# Altium schematic sheet MiniProject Schematic 2025.SchDoc: Mimi Project Circuit Schematic EC463
size A
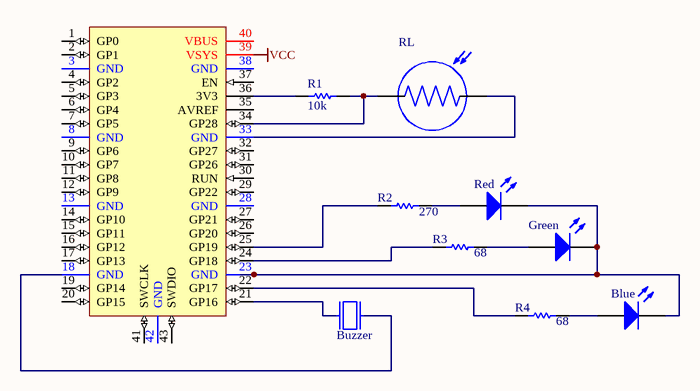
[diagram p0: MiniProject Schematic 2025.SchDoc]

## Parts
?  (no value)  [RPI-PICO-MOD]
Blue  Light-Emitting Diode  (value not drawn)
Green  Light-Emitting Diode  (value not drawn)
R1  value 10k  (hidden comment: Resistor)
R2  value 270  (hidden comment: Resistor)
R3  value 68  (hidden comment: Resistor)
R4  value 68  (hidden comment: Resistor)
Red  Light-Emitting Diode  (value not drawn)
RL  (no value)  [XDCR_PDV-P8003]

## Nets
VCC: ?.39(VSYS)
Net?_22: ?.22(GP17) R4.1
Net?_23: ?.23(GND) Blue.2(K) Green.2(K) Red.2(K)
Net?_24: ?.24(GP18) R3.1
Net?_25: ?.25(GP19) R2.1
Net?_33: ?.33(GND) RL.2
Net?_34: ?.34(GP28) R1.2 RL.1
Net?_36: ?.36(3V3) R1.1
NetBlue_1: Blue.1(A) R4.2
NetGreen_1: Green.1(A) R3.2
NetR2_2: R2.2 Red.1(A)

Not connected (* = marked no-connect by the designer): ? 1(GP0) 2(GP1) 3(GND) 4(GP2) 5(GP3) 6(GP4) 7(GP5) 8(GND) 9(GP6) 10(GP7) 11(GP8) 12(GP9) 13(GND) 14(GP10) 15(GP11) 16(GP12) 17(GP13) 18(GND) 19(GP14) 20(GP15) 21(GP16) 26(GP20) 27(GP21) 28(GND) 29(GP22) 30(RUN) 31(GP26) 32(GP27) 35(AVREF) 37(EN) 38(GND) 40(VBUS) 41(SWCLK) 42(GND) 43(SWDIO)

## Notes on the sheet
- Buzzer

## Library data of the parts
? = RPI-PICO-MOD_SM: RASPBERRY PI PICO RP2040 BOARD NO TEST PADS; Manufacturer: Raspberry Pi Foundation; Manufacturer Part No: SC0915; Mounting Technology: SMT; Supplier: DigiKey; Supplier Part No: 2648-SC0915CT-ND; Supplier Link: https://www.digikey.com/en/products/detail/raspberry-pi/SC0915/13684020
Blue Green Red = LED: AF: 1; BV: 0; BV_MAX: 1e99; EG: 1.11; FC: 0.5; IBV: 0.001; IS: 1e-14; MJSW: 0.33; NTUN: 30; TNOM: 27; XTI: 3; SimulationGenericComponent: True; CJO: 0; CJP: 0; CTA: 0; CTP: 0; FCS: 0.5; FV_MAX: 1e99; IKF: 0; IKR: 0; ISR: 1e-14; JSW: 0; JTUN: 0; JTUNSW: 0; KEG: 1; KF: 0; LEVEL: 1; N: 1; NBV: 1; NR: 1; NS: 1; PHP: 1; RS: 0; TCV: 0; TLEV: 0; TLEVC: 0; TM1: 0; TM2: 0; TPB: 0; TPHP: 0; TRS: 0; TRS2: 0; TT: 0; TTT1: 0; TTT2: 0; VJ: 1; XTITUN: 3
R1-R4 = Resistor: TC1: 0; SimulationGenericComponent: True; TC2: 0
RL = PDV-P8003: CdS Cells 520nm 16 ~ 33kOhms @ 10 lux; MF: Advanced Photonix; SnapEDA_Link: https://www.snapeda.com/parts/PDV-P8003/Advanced+Photonix/view-part/?ref=snap; Package: Radial Advanced Photonix; Value: *; MP: PDV-P8003; Check_prices: https://www.snapeda.com/parts/PDV-P8003/Advanced+Photonix/view-part/?ref=eda